# Altium project YK.PrjPCB
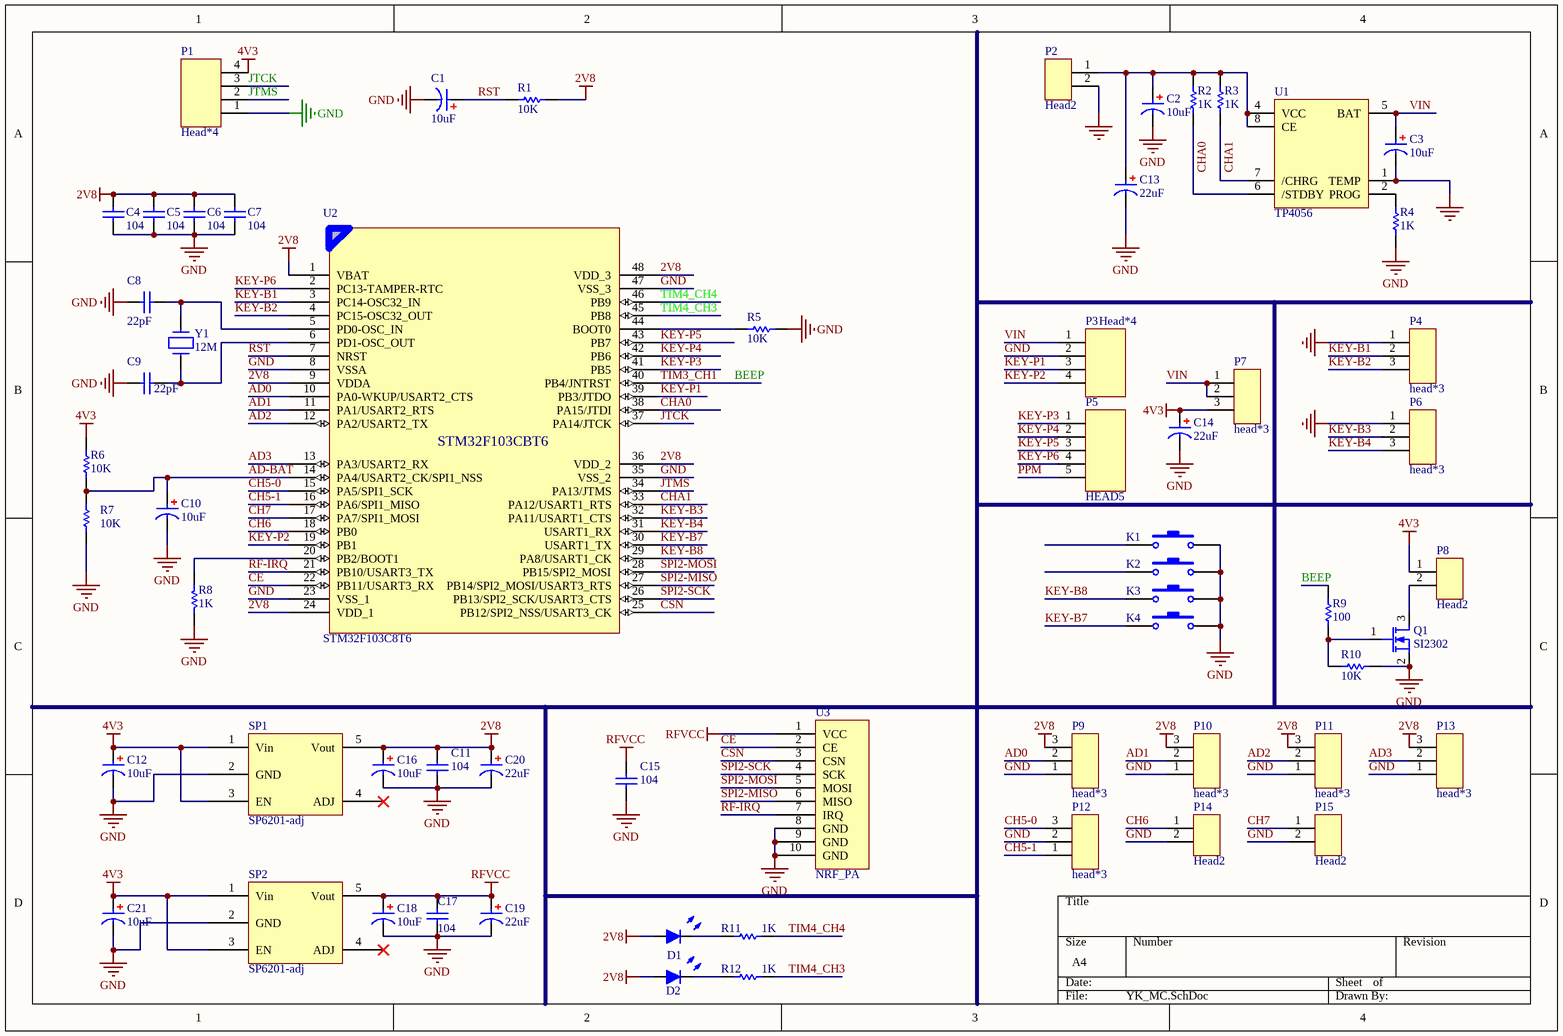
[diagram p0: YK_MC.SchDoc]
1 sheet, 61 parts. Net scope: global (net labels, ports and power ports of the same name join across sheets).
Board file: remote.PcbDoc

## Sheet YK_MC.SchDoc
size A4

### Parts
C1  C10uF  [0603C]  (value not drawn)
C2  C10uF  [0603C]  (value not drawn)
C3  C10uF  [0603C]  (value not drawn)
C4  C0.1uF  [0603C]  (value not drawn)
C5  C0.1uF  [0603C]  (value not drawn)
C6  C0.1uF  [0603C]  (value not drawn)
C7  C0.1uF  [0603C]  (value not drawn)
C8  C22pF  [0603R]  (value not drawn)
C9  C22pF  [0603R]  (value not drawn)
C10  C10uF  [0603C]  (value not drawn)
C11  C0.1uF  [0603C]  (value not drawn)
C12  C10uF  [0603C]  (value not drawn)
C13  22uF  [0603C]
C14  22uF  [0603C]
C15  C0.1uF  [0603C]  (value not drawn)
C16  C10uF  [0603C]  (value not drawn)
C17  C0.1uF  [0603C]  (value not drawn)
C18  C10uF  [0603C]  (value not drawn)
C19  22uF  [0603C]
C20  22uF  [0603C]
C21  C10uF  [0603C]  (value not drawn)
D1  LED  [LED]  (value not drawn)
D2  LED  [LED]  (value not drawn)
K1  KEY-PB  [SW-DIP]  (value not drawn)
K2  KEY-PB  [SW-DIP]  (value not drawn)
K3  KEY-PB  [SW-DIP]  (value not drawn)
K4  KEY-PB  [SW-DIP]  (value not drawn)
P1  Head*4  [Head4_SPE4]
P2  Head2  [HEAD-2P-2.0]
P3  Head*4  [Head4_SPE4]
P4  head*3  [KEY_SPE2]
P5  HEAD5  [HEAD5_SPE5]
P6  head*3  [KEY_SPE2]
P7  head*3  [SWITCH_3P]
P8  Head2  [BEEP]
P9  head*3  [HEAD-3P-2.0]
P10  head*3  [HEAD-3P-2.0]
P11  head*3  [HEAD-3P-2.0]
P12  head*3  [HEAD-3P-2.0]
P13  head*3  [HEAD-3P-2.0]
P14  Head2  [HEAD-2P-2.0]
P15  Head2  [HEAD-2P-2.0]
Q1  SI2302  [SOT-23-3]
R1  R10K  [0603R]  (value not drawn)
R2  R1K  [0603R]  (value not drawn)
R3  R1K  [0603R]  (value not drawn)
R4  1K  [0603R]
R5  R10K  [0603R]  (value not drawn)
R6  R10K  [0603R]  (value not drawn)
R7  R10K  [0603R]  (value not drawn)
R8  1K  [0603R]
R9  R100R  [0603R]  (value not drawn)
R10  R10K  [0603R]  (value not drawn)
R11  R1K  [0603R]  (value not drawn)
R12  R1K  [0603R]  (value not drawn)
SP1  SP6201-adj  [SOT23-5]
SP2  SP6201-adj  [SOT23-5]
U1  TP4056  [SOP-8]
U2  STM32F103C8T6  [STM32C8T6]
U3  NRF_PA  [NRF_PA]
Y1  12M  [XTAL3225]

### Nets
2V8: C4.2 C5.2 C6.2 C7.2 C11.2 C16.1 C20.1 D1.1(A) D2.1(A) P9.3 P10.3 P11.3 P13.3 R1.2 SP1.5(Vout) U2.1(VBAT) U2.9(VDDA) U2.24(VDD_1) U2.36(VDD_2) U2.48(VDD_3)
4V3: C12.1 C14.1 C21.1 P1.4 P7.3 P8.1 R6.1 SP1.1(Vin) SP1.3(EN) SP2.1(Vin) SP2.3(EN)
GND: C1.2 C2.2 C3.2 C4.1 C5.1 C6.1 C7.1 C8.1 C9.1 C10.2 C11.1 C12.2 C13.2 C14.2 C15.1 C16.2 C17.1 C18.2 C19.2 C20.2 C21.2 K1.2 K2.2 K3.2 K4.2 P1.1 P2.2 P3.2 P4.1 P6.1 P9.1 P10.1 P11.1 P12.2 P13.1 P14.2 P15.2 Q1.2(S) R4.1 R5.2 R7.1 R8.1 R10.2 SP1.2(GND) SP2.2(GND) U1.1(TEMP) U1.3(GND) U2.8(VSSA) U2.23(VSS_1) U2.35(VSS_2) U2.47(VSS_3) U3.8(GND) U3.9(GND) U3.10(GND)
RFVCC: C15.2 C17.2 C18.1 C19.1 SP2.5(Vout) U3.1(VCC)
AD0: P9.2 U2.10(PA0-WKUP/USART2_CTS)
AD1: P10.2 U2.11(PA1/USART2_RTS)
AD2: P11.2 U2.12(PA2/USART2_TX)
AD3: P13.2 U2.13(PA3/USART2_RX)
AD-BAT: C10.1 R6.2 R7.2 U2.14(PA4/USART2_CK/SPI1_NSS)
BEEP: R9.2 U2.40(PB4/JNTRST)  [also labelled TIM3_CH1]
CE: U2.22(PB11/USART3_RX) U3.2(CE)
CH5-0: P12.3 U2.15(PA5/SPI1_SCK)
CH5-1: P12.1 U2.16(PA6/SPI1_MISO)
CH6: P14.1 U2.18(PB0)
CH7: P15.1 U2.17(PA7/SPI1_MOSI)
CHA0: R2.1 U1.6(/STDBY) U2.38(PA15/JTDI)
CHA1: R3.1 U1.7(/CHRG) U2.33(PA12/USART1_RTS)
CSN: U2.25(PB12/SPI2_NSS/USART3_CK) U3.3(CSN)
JTCK: P1.3 U2.37(PA14/JTCK)
JTMS: P1.2 U2.34(PA13/JTMS)
KEY-B1: P4.2 U2.3(PC14-OSC32_IN)
KEY-B2: P4.3 U2.4(PC15-OSC32_OUT)
KEY-B3: P6.2 U2.32(PA11/USART1_CTS)
KEY-B4: P6.3 U2.31(USART1_RX)
KEY-B7: K4.1 U2.30(USART1_TX)
KEY-B8: K3.1 U2.29(PA8/USART1_CK)
KEY-P1: P3.3 U2.39(PB3/JTDO)
KEY-P2: P3.4 U2.19(PB1)
KEY-P3: P5.1 U2.41(PB5)
KEY-P4: P5.2 U2.42(PB6)
KEY-P5: P5.3 U2.43(PB7)
KEY-P6: P5.4 U2.2(PC13-TAMPER-RTC)
PPM: P5.5
RF-IRQ: U2.21(PB10/USART3_TX) U3.7(IRQ)
RST: C1.1 R1.1 U2.7(NRST)
SPI2-MISO: U2.27(PB14/SPI2_MOSI/USART3_RTS) U3.6(MISO)
SPI2-MOSI: U2.28(PB15/SPI2_MOSI) U3.5(MOSI)
SPI2-SCK: U2.26(PB13/SPI2_SCK/USART3_CTS) U3.4(SCK)
TIM4_CH3: R12.2 U2.45(PB8)
TIM4_CH4: R11.2 U2.46(PB9)
VIN: C3.1 P3.1 P7.1 P7.2 U1.5(BAT)
NetC2_1: C2.1 C13.1 P2.1 R2.2 R3.2 U1.4(VCC) U1.8(CE)
NetC8_2: C8.2 U2.5(PD0-OSC_IN) Y1.1
NetC9_2: C9.2 U2.6(PD1-OSC_OUT) Y1.3
NetD1_2: D1.2(K) R11.1
NetD2_2: D2.2(K) R12.1
NetP8_2: P8.2 Q1.3(D)
NetQ1_1: Q1.1(G) R9.1 R10.1
NetR4_2: R4.2 U1.2(PROG)
NetR5_1: R5.1 U2.44(BOOT0)
NetR8_2: R8.2 U2.20(PB2/BOOT1)

Not connected (* = marked no-connect by the designer): K1 1; K2 1; SP1 4(ADJ)*; SP2 4(ADJ)*

### Notes on the sheet
- (in symbol C0.1uF) 104
- (in symbol C10uF) 10uF
- (in symbol C22pF) 22pF
- (in symbol R1K) 1K
- (in symbol R10K) 10K
- (in symbol R100K) 10K
- (in symbol R100R) 100
- (in symbol STM32F103C8T6) STM32F103CBT6

### Library data of the parts
C13 C14 C19 C20 = C100uF
Q1 = MOSFET-N
R4 = R1K
R6 R7 = R100K
R8 = R10K
SP1 SP2 = SP6201
Y1 = CRYSTAL